# EAGLE design FETbox_rev0_PCB (EAGLE 9.6.2)
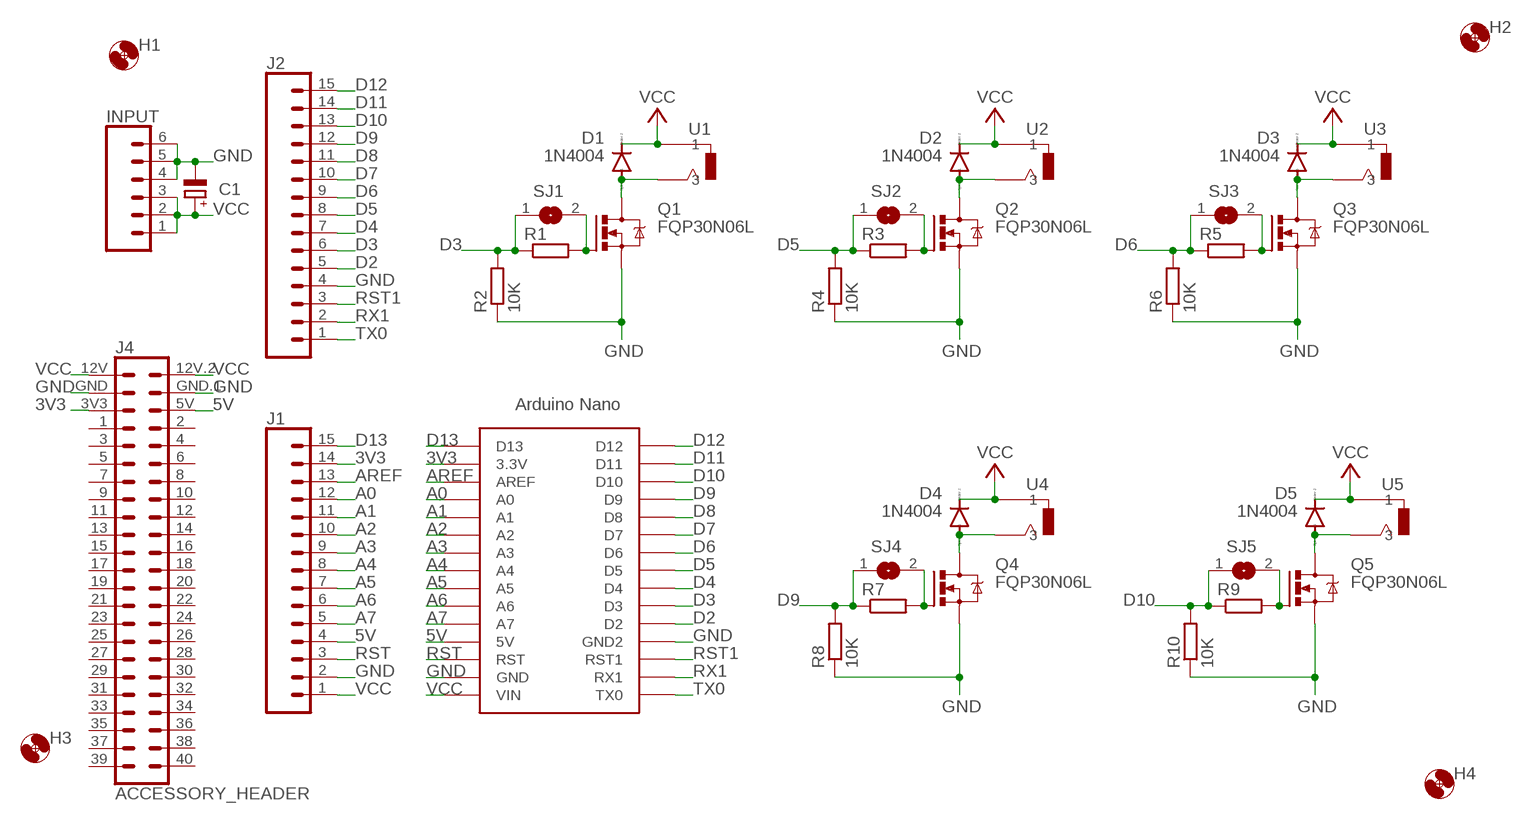
[diagram p0: schematic, sheet 1]

## Parts
C1  CPOL-EUE2.5-6  [E2,5-6]
D1  1N4004  [DO41-10]
D2  1N4004  [DO41-10]
D3  1N4004  [DO41-10]
D4  1N4004  [DO41-10]
D5  1N4004  [DO41-10]
H1  MOUNT-HOLE3.0  [3,0]
H2  MOUNT-HOLE3.0  [3,0]
H3  MOUNT-HOLE3.0  [3,0]
H4  MOUNT-HOLE3.0  [3,0]
INPUT  CONN_06LONGPADS  [1X06_LONGPADS]
J1  CONN_15  [1X15]
J2  CONN_15  [1X15]
J4  ACCESSORY_HEADER  [2X23]
Q1  FQP30N06L  [TO220]
Q2  FQP30N06L  [TO220]
Q3  FQP30N06L  [TO220]
Q4  FQP30N06L  [TO220]
Q5  FQP30N06L  [TO220]
R1  100  R-EU_0207/10  [0207/10]
R2  10K  R-EU_0207/10  [0207/10]
R3  100  R-EU_0207/10  [0207/10]
R4  10K  R-EU_0207/10  [0207/10]
R5  100  R-EU_0207/10  [0207/10]
R6  10K  R-EU_0207/10  [0207/10]
R7  100  R-EU_0207/10  [0207/10]
R8  10K  R-EU_0207/10  [0207/10]
R9  100  R-EU_0207/10  [0207/10]
R10  10K  R-EU_0207/10  [0207/10]
SJ1  SJ  [SJ]
SJ2  SJ  [SJ]
SJ3  SJ  [SJ]
SJ4  SJ  [SJ]
SJ5  SJ  [SJ]
U1  CL13845G  [CL13845G]
U2  CL13845G  [CL13845G]
U3  CL13845G  [CL13845G]
U4  CL13845G  [CL13845G]
U5  CL13845G  [CL13845G]
U$2  NANO  [NANO]

## Nets
3V3: J1.14 J4.3V3 U$2.3.3V
5V: J1.4 J4.5V U$2.5V
A0: J1.12 U$2.A0
A1: J1.11 U$2.A1
A2: J1.10 U$2.A2
A3: J1.9 U$2.A3
A4: J1.8 U$2.A4
A5: J1.7 U$2.A5
A6: J1.6 U$2.A6
A7: J1.5 U$2.A7
AREF: J1.13 U$2.AREF
D2: J2.5 U$2.D2
D3: J2.6 R1.1 R2.2 SJ1.1 U$2.D3
D4: J2.7 U$2.D4
D5: J2.8 R3.1 R4.2 SJ2.1 U$2.D5
D6: J2.9 R5.1 R6.2 SJ3.1 U$2.D6
D7: J2.10 U$2.D7
D8: J2.11 U$2.D8
D9: J2.12 R7.1 R8.2 SJ4.1 U$2.D9
D10: J2.13 R9.1 R10.2 SJ5.1 U$2.D10
D11: J2.14 U$2.D11
D12: J2.15 U$2.D12
D13: J1.15 U$2.D13
GND: C1.- INPUT.4 INPUT.5 INPUT.6 J1.2 J2.4 J4.GND J4.GND.1 Q1.S Q2.S Q3.S Q4.S Q5.S R2.1 R4.1 R6.1 R8.1 R10.1 U$2.GND U$2.GND1(GND2)
N$1: Q1.G R1.2 SJ1.2
N$2: D1.A Q1.D U1.S1 U1.S2
N$3: D2.A Q2.D U2.S1 U2.S2
N$4: Q2.G R3.2 SJ2.2
N$5: D3.A Q3.D U3.S1 U3.S2
N$6: Q3.G R5.2 SJ3.2
N$7: D4.A Q4.D U4.S1 U4.S2
N$8: Q4.G R7.2 SJ4.2
N$9: D5.A Q5.D U5.S1 U5.S2
N$10: Q5.G R9.2 SJ5.2
RST: J1.3 U$2.RST
RST1: J2.3 U$2.RST1
RX1: J2.2 U$2.RX1
TX0: J2.1 U$2.TX0
VCC: C1.+ D1.C D2.C D3.C D4.C D5.C INPUT.1 INPUT.2 INPUT.3 J1.1 J4.12V J4.12V.2(12V.1) U1.T1 U1.T2 U2.T1 U2.T2 U3.T1 U3.T2 U4.T1 U4.T2 U5.T1 U5.T2 U$2.RAW(VIN)
Unconnected: J4.1 J4.2 J4.3 J4.4 J4.5 J4.6 J4.7 J4.8 J4.9 J4.10 J4.11 J4.12 J4.13 J4.14 J4.15 J4.16 J4.17 J4.18 J4.19 J4.20 J4.21 J4.22 J4.23 J4.24 J4.25 J4.26 J4.27 J4.28 J4.29 J4.30 J4.31 J4.32 J4.33 J4.34 J4.35 J4.36 J4.37 J4.38 J4.39 J4.40

## Library data of the parts
C1 = rcl:CPOL-EU: POLARIZED CAPACITOR, European symbol; SPICEPREFIX: C
D1-D5 = diode:1N4004: DIODE general purpose rectifier, 1 A
H1-H4 = holes:MOUNT-HOLE: MOUNTING HOLE with drill center marker
INPUT = SparkFun-Connectors:CONN_06: Multi connection point. Often used as Generic Header-pin footprint for 0.1 inch spaced/style header connections On any of the 0.1 inch spaced packages, you can populate with these: Break Away Headers - Straight <https://www.sparkfun.com/products/116> (PRT-00116) Break Away Male Headers - Right Angle <https://www.sparkfun.com/products/553> (PRT-00553) Female Headers <https://www.sparkfun.com/products/115> (PRT-00115) Break Away Headers - Machine Pin <https://www.sparkfun.com/products/117> (PRT-00117) Break Away Female Headers - Swiss Machine Pin <https://www.sparkfun.com/products/743> (PRT-00743) Arduino Stackable Header - 6 Pin <https://www.sparkfun.com/products/9280> (PRT-09280) For SCREWTERMINALS and SPRING TERMINALS visit here: Screw Terimnals on SparkFun.com <https://www.sparkfun.com/search/results?term=Screw+Terminals> (5mm/3.5mm/2.54mm spacing) This device is also useful as a general connection point to wire up your design to another part of your project. Our various solder wires solder well into these plated through hole pads. Hook-Up Wire - Assortment (Stranded, 22 AWG) <https://www.sparkfun.com/products/11375> (PRT-11375) Hook-Up Wire - Assortment (Solid Core, 22 AWG) <https://www.sparkfun.com/products/11367> (PRT-11367) View the entire wire category on our website here <https://www.sparkfun.com/categories/141>
J1 J2 = SparkFun-Connectors:CONN_15: Multi connection point. Often used as Generic Header-pin footprint for 0.1 inch spaced/style header connections On any of the 0.1 inch spaced packages, you can populate with these: Break Away Headers - Straight <https://www.sparkfun.com/products/116> (PRT-00116) Break Away Male Headers - Right Angle <https://www.sparkfun.com/products/553> (PRT-00553) Female Headers <https://www.sparkfun.com/products/115> (PRT-00115) Break Away Headers - Machine Pin <https://www.sparkfun.com/products/117> (PRT-00117) Break Away Female Headers - Swiss Machine Pin <https://www.sparkfun.com/products/743> (PRT-00743) For SCREWTERMINALS and SPRING TERMINALS visit here: Screw Terimnals on SparkFun.com <https://www.sparkfun.com/search/results?term=Screw+Terminals> (5mm/3.5mm/2.54mm spacing) This device is also useful as a general connection point to wire up your design to another part of your project. Our various solder wires solder well into these plated through hole pads. Hook-Up Wire - Assortment (Stranded, 22 AWG) <https://www.sparkfun.com/products/11375> (PRT-11375) Hook-Up Wire - Assortment (Solid Core, 22 AWG) <https://www.sparkfun.com/products/11367> (PRT-11367) View the entire wire category on our website here <https://www.sparkfun.com/categories/141> Special notes: Molex polarized connector foot print use with SKU : PRT-08231 with associated crimp pins and housings. 1MM SMD Version SKU: PRT-10208 NOTES ON THE VARIANTS LOCK and LOCK_LONGPADS... This footprint was designed to help hold the alignment of a through-hole component (i.e. 6-pin header) while soldering it into place. You may notice that each hole has been shifted either up or down by 0.005 of an inch from it's more standard position (which is a perfectly straight line). This slight alteration caused the pins (the squares in the middle) to touch the edges of the holes. Because they are alternating, it causes a "brace" to hold the component in place. 0.005 has proven to be the perfect amount of "off-center" position when using our standard breakaway headers. Although looks a little odd when you look at the bare footprint, once you have a header in there, the alteration is very hard to notice. Also,if you push a header all the way into place, it is covered up entirely on the bottom side.
J4 = PerfusionHardwareController:ACCESSORY_HEADER
Q1-Q5 = PerfusionHardwareController:FQP30N06L: QFET Power MOSFET
R1-R10 = rcl:R-EU_: RESISTOR, European symbol; SPICEPREFIX: R
SJ1-SJ5 = jumper:SJ: SMD solder JUMPER
U1-U5 = PerfusionHardwareController:CL13845G
U$2 = Arduino-clone:NANO: Arduino Nano

## Net classes
0 default: width 0.305 mm, clearance 0.254 mm

## Board
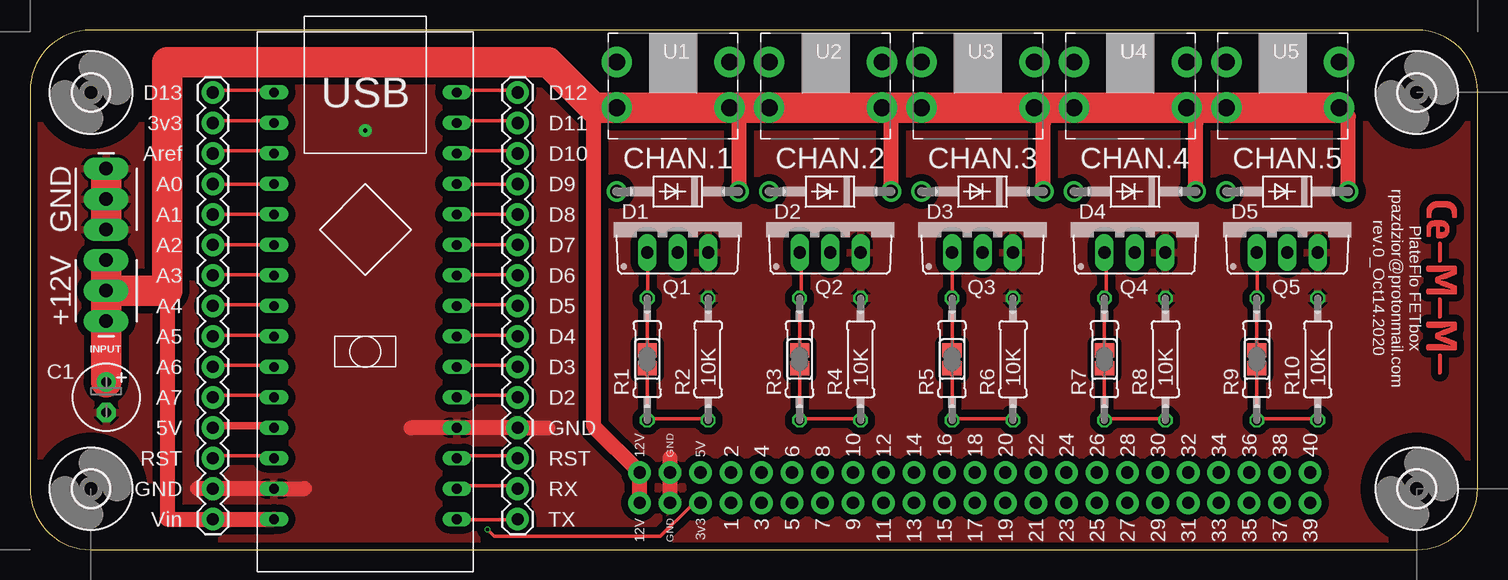
[diagram p1: board, top side]
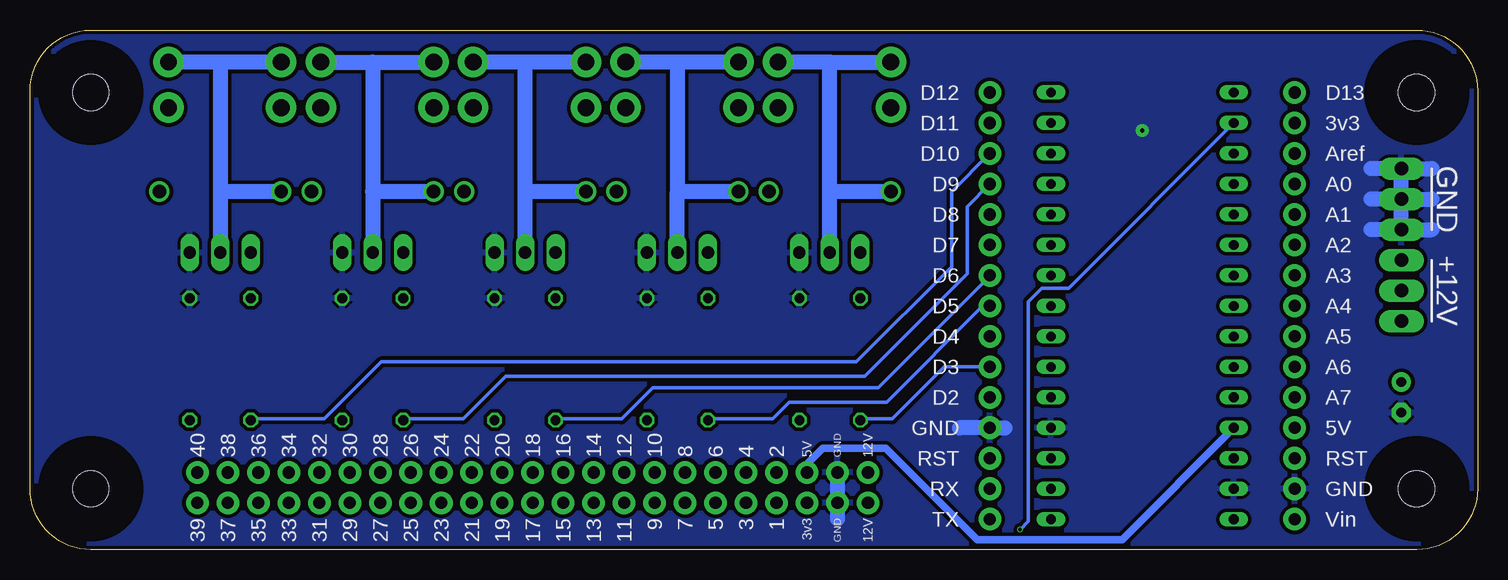
[diagram p2: board, bottom side, seen from below]

Size 120.63 x 43.31 mm. Coordinates in mm from the lower left corner, seen from the top.
Outline: 0,38.23 0,5.08 arc90 5.08,0 115.55,0 arc90 120.63,5.09 120.63,38.21 arc90 115.55,43.31 5.08,43.31 arc90 0,38.23
Copper layers (1*16): Top 0.035559375mm / dielectric 1.6mm / Bottom 0.035559375mm
Design rules "jlcpcb2layer": minimum track width 5mil, minimum drill 12mil, track to track 5mil, track to pad 5mil, pad to pad 5mil, via to via 5mil, smd to smd 5mil, copper to edge 8mil, drill to drill 6mil, minimum pad ring 5mil, minimum via ring 3mil, stop-mask expansion 2.5mil, vias tented up to drill 0mil, thermal gap 10mil

### Footprints (pad centres in the part's own frame; a part is rotated, then mirrored left to right if it is on the bottom)
E2,5-6 = drill 0.813 pad 1.6: + -1.27,0 | drill 0.813 pad 1.6 octagon: - 1.27,0
DO41-10 = drill 1.118: A 5.08,0; C -5.08,0
3,0 = hole 3: 0,0
1X06_LONGPADS = drill 1.118 pad 1.88 long: 1 0,0; 2 2.54,0; 3 5.08,0; 4 7.62,0; 5 10.16,0; 6 12.7,0
1X15 = drill 1.016 pad 1.88: 1 0,0; 2 2.54,0; 3 5.08,0; 4 7.62,0; 5 10.16,0; 6 12.7,0; 7 15.24,0; 8 17.78,0; 9 20.32,0; 10 22.86,0; 11 25.4,0; 12 27.94,0; 13 30.48,0; 14 33.02,0; 15 35.56,0
2X23 = drill 1.016 pad 1.88: 1 0,0; 2 0,2.54; 3 2.54,0; 3V3 -2.54,0; 4 2.54,2.54; 5 5.08,0; 5V -2.54,2.54; 6 5.08,2.54; 7 7.62,0; 8 7.62,2.54; 9 10.16,0; 10 10.16,2.54; 11 12.7,0; 12 12.7,2.54; 12V -7.62,0; 12V.2 -7.62,2.54; 13 15.24,0; 14 15.24,2.54; 15 17.78,0; 16 17.78,2.54; 17 20.32,0; 18 20.32,2.54; 19 22.86,0; 20 22.86,2.54; 21 25.4,0; 22 25.4,2.54; 23 27.94,0; 24 27.94,2.54; 25 30.48,0; 26 30.48,2.54; 27 33.02,0; 28 33.02,2.54; 29 35.56,0; 30 35.56,2.54; 31 38.1,0; 32 38.1,2.54; 33 40.64,0; 34 40.64,2.54; 35 43.18,0; 36 43.18,2.54; 37 45.72,0; 38 45.72,2.54; 39 48.26,0; 40 48.26,2.54; GND -5.08,0; GND.1 -5.08,2.54
TO220 = drill 1.016 long: D 0,-2.54; G -2.54,-2.54; S 2.54,-2.54
0207/10 = drill 0.813 octagon: 1 -5.08,0; 2 5.08,0
SJ = smd 1.168 x 1.6: 1 -0.762,0; 2 0.762,0
CL13845G = drill 1.4 pad 2.54: S1 0,0; S2 9.4,0; T1 0,-3.8; T2 9.4,-3.8
NANO = drill 0.8 long: 3.3V -7.62,-2.54; 5V -7.62,-27.94; A0 -7.62,-7.62; A1 -7.62,-10.16; A2 -7.62,-12.7; A3 -7.62,-15.24; A4 -7.62,-17.78; A5 -7.62,-20.32; A6 -7.62,-22.86; A7 -7.62,-25.4; AREF -7.62,-5.08; D2 7.62,-25.4; D3 7.62,-22.86; D4 7.62,-20.32; D5 7.62,-17.78; D6 7.62,-15.24; D7 7.62,-12.7; D8 7.62,-10.16; D9 7.62,-7.62; D10 7.62,-5.08; D11 7.62,-2.54; D12 7.62,0; D13 -7.62,0; GND -7.62,-33.02; GND1 7.62,-27.94; RAW -7.62,-35.56; RST -7.62,-30.48; RST1 7.62,-30.48; RX1 7.62,-33.02; TX0 7.62,-35.56

### Placement (x,y rotation side)
C1  6.35,12.7 270 top
D1  53.98,29.84 180 top
D2  66.67,29.84 180 top
D3  79.38,29.84 180 top
D4  92.08,29.84 180 top
D5  104.78,29.84 180 top
H1  115.57,38.1 0 top
H2  5.08,38.1 0 top
H3  5.08,5.08 0 top
H4  115.57,5.08 0 top
INPUT  6.35,19.05 90 top
J1  15.24,2.54 90 top
J2  40.64,2.54 90 top
J4  58.42,3.9 0 top
Q1  53.98,27.3 0 top
Q2  66.67,27.3 0 top
Q3  79.38,27.3 0 top
Q4  92.08,27.3 0 top
Q5  104.78,27.3 0 top
R1  51.44,15.88 90 top
R2  56.52,15.88 270 top
R3  64.14,15.88 90 top
R4  69.22,15.88 270 top
R5  76.83,15.88 90 top
R6  81.92,15.88 270 top
R7  89.53,15.88 90 top
R8  94.61,15.88 270 top
R9  102.23,15.88 90 top
R10  107.31,15.88 270 top
SJ1  51.44,15.88 90 top
SJ2  64.14,15.88 90 top
SJ3  76.83,15.88 90 top
SJ4  89.53,15.88 90 top
SJ5  102.23,15.88 90 top
U1  48.9,40.64 0 top
U2  61.59,40.64 0 top
U3  74.3,40.64 0 top
U4  87,40.64 0 top
U5  99.69,40.64 0 top
U$2  27.94,38.1 0 top

### Tracks (layer width: path | path; a pad name or v marks a point on that pad's centre or on a via)
3V3  (via drill 0.3)
  Top 0.305: U$2.3.3V 20.12,35.76 15.37,35.76 J1.14 | v38.12,1.68 38.68,1.12 52.53,1.12 55.04,3.63 55.88,3.63 J4.3V3
  Bottom 0.305: v38.12,1.68 37.44,2.36 37.44,20.68 36.32,21.79 34.09,21.79 U$2.3.3V
5V
  Top 0.305: 20.12,10.34 U$2.5V | 15.37,10.34 J1.4
  Top 0.61: 15.37,10.34 20.12,10.34
  Bottom 0.305: 20.4,10.06 U$2.5V
  Bottom 0.61: J4.5V 55.88,7.14 54.56,8.46 49.33,8.46 41.71,0.84 29.62,0.84 20.4,10.06
A0
  Top 0.305: U$2.A0 20.12,30.45 15.37,30.45 J1.12
A1
  Top 0.305: J1.11 U$2.A1
A2
  Top 0.305: U$2.A2 20.12,25.43 15.37,25.43 J1.10
A3
  Top 0.305: U$2.A3 20.12,22.91 15.37,22.91 J1.9
A4
  Top 0.305: U$2.A4 20.12,20.4 15.37,20.4 J1.8
A5
  Top 0.305: U$2.A5 20.12,17.88 15.37,17.88 J1.7
A6
  Top 0.305: U$2.A6 20.12,15.37 15.37,15.37 J1.6
A7
  Top 0.305: U$2.A7 20.12,12.85 15.37,12.85 J1.5
AREF
  Top 0.305: U$2.AREF 20.12,33.25 15.37,33.25 J1.13
D2
  Top 0.305: U$2.D2 35.76,12.85 40.51,12.85 J2.5
D3
  Top 0.305: R2.2 56.52,10.9 51.49,10.9 R1.1 SJ1.1 | U$2.D3 35.76,15.37 40.51,15.37 J2.6
  Bottom 0.305: J2.6 44.45,15.24 48.79,10.9 51.21,10.9 R1.1
D4
  Top 0.305: U$2.D4 35.76,17.88 40.51,17.88 J2.7
D5
  Top 0.305: R4.2 69.01,10.9 64.26,10.9 R3.1 SJ2.1 | U$2.D5 35.76,20.4 40.51,20.4 J2.8
  Bottom 0.305: J2.8 41.22,20.32 49.25,12.29 57.35,12.29 58.75,10.9 63.98,10.9 R3.1
D6
  Top 0.305: R6.2 81.86,10.9 76.83,10.9 R5.1 SJ3.1 | U$2.D6 35.76,22.91 40.51,22.91 J2.9
  Bottom 0.305: R5.1 76.83,10.9 71.32,10.9 68.73,13.49 49.94,13.49 40.64,22.78 J2.9
D7
  Top 0.305: U$2.D7 35.76,25.43 40.51,25.43 J2.10
D8
  Top 0.305: J2.11 U$2.D8
D9
  Top 0.305: R8.2 94.44,10.9 89.69,10.9 R7.1 SJ4.1 | U$2.D9 35.76,30.45 40.51,30.45 J2.12
  Bottom 0.305: J2.12 42.55,28.57 42.55,22.99 51.08,14.45 80.97,14.45 84.53,10.9 89.41,10.9 R7.1
D10
  Top 0.305: R10.2 107.29,10.9 102.26,10.9 R9.1 SJ5.1 | U$2.D10 35.76,33.25 40.51,33.25 J2.13
  Bottom 0.305: J2.13 43.81,29.84 43.81,23.6 51.77,15.65 91.36,15.65 96.11,10.9 101.98,10.9 R9.1
D11
  Top 0.305: U$2.D11 35.76,35.76 40.51,35.76 J2.14
D12
  Top 0.305: U$2.D12 35.76,38.28 40.51,38.28 J2.15
D13
  Top 0.305: U$2.D13 20.12,38.28 15.37,38.28 J1.15
GND  (via drill 0.35 pad 1.05)
  Top 0.305: J4.GND.1 53.37,6.43 53.37,6.31
  Top 1.27: 22.86,5.08 U$2.GND 13.97,5.08 | 43.18,10.16 J2.4 31.75,10.16 | J4.GND 53.34,7.62
  Top 2.54: 6.35,27.05 INPUT.5 6.35,31.24
  Bottom 0.305: 53.37,4.19 J4.GND
  Bottom 1.27: J4.GND.1 J4.GND 53.34,2.54 | 8.89,29.21 INPUT.5 3.81,29.21 | INPUT.6 8.89,31.75 | INPUT.6 3.81,31.75 | INPUT.4 INPUT.6 | INPUT.4 3.81,26.67 | INPUT.4 8.89,26.67 | 39.37,10.16 J2.4 43.18,10.16
  other vias: 27.94,34.92
  pour Bottom (isolate 0.305): 0,43.18 0,0 120.65,0 120.65,43.18
  pour Top (isolate 0.61): 0,43.18 0,0 121.28,0 121.28,43.18
N$1
  Top 0.305: Q1.G 51.49,24.59 51.49,20.95 R1.2 SJ1.2
N$2
  Bottom 1.27: D1.A 53.98,29.84 | Q1.D 53.98,29.84 | 53.98,29.84 53.98,40.64 | 53.98,40.64 U1.S1 | 53.98,40.64 U1.S2
N$3
  Bottom 1.27: Q2.D 66.67,29.84 | D2.A 66.67,29.84 | U2.S1 66.67,40.64 | 66.67,40.64 U2.S2 | 66.67,40.64 66.67,29.84
N$4
  Top 0.305: 64.26,20.95 64.26,24.59 Q2.G | 64.26,20.95 R3.2 | SJ2.2 64.14,20.83 64.26,20.95
N$5
  Bottom 1.27: Q3.D 79.38,29.84 | 79.38,29.84 79.38,40.64 | 79.38,40.64 U3.S2 | U3.S1 79.38,40.64 | D3.A 79.38,29.84
N$6
  Top 0.305: Q3.G R5.2 SJ3.2
N$7
  Bottom 1.27: D4.A 92.08,29.84 | 92.08,29.84 Q4.D | U4.S2 92.08,40.64 | 92.08,40.64 U4.S1 | 92.08,40.64 92.08,29.84
N$8
  Top 0.305: Q4.G 89.69,24.59 89.69,20.95 R7.2 SJ4.2
N$9
  Bottom 1.27: U5.S1 104.78,40.64 | 104.78,40.64 U5.S2 | 104.78,40.64 104.78,29.84 | D5.A 104.78,29.84 | 104.78,29.84 Q5.D
N$10
  Top 0.305: Q5.G 102.26,24.59 102.26,20.95 R9.2 SJ5.2
RST
  Top 0.305: U$2.RST 20.12,7.82 15.37,7.82 J1.3
RST1
  Top 0.305: J2.3 40.51,7.82 35.76,7.82 U$2.RST1
RX1
  Top 0.305: U$2.RX1 35.76,5.31 40.51,5.31 J2.2
TX0
  Top 0.305: U$2.TX0 35.76,2.52 40.51,2.52 J2.1
VCC
  Top 0.305: 84.45,35.56 84.66,35.76 84.66,36.84 | 97.16,35.56 97.23,35.76 97.23,36.84 | U4.T1 86.89,36.88 86.89,36.84 | U4.T2 96.39,36.88 U4.T2 | U5.T1 99.75,36.88 99.75,36.84 | 46.99,35.76 46.94,35.76 46.99,36.83 | INPUT.3 6.37,24.1 6.35,23.75 | 6.35,20.95 6.43,20.95 INPUT.2
  Top 1.27: 11.43,21.59 11.43,2.54 J1.1 U$2.RAW | J4.12V J4.12V.2 46.99,10.25 46.99,35.76 | U1.T2 59.05,36.08 D1.C | U2.T2 71.75,36.08 D2.C | D3.C 84.45,35.56 | D4.C 97.16,35.56 | U5.T2 109.86,36.08 D5.C
  Top 2.54: U1.T2 U1.T1 48.88,36.83 46.99,36.83 43.18,40.64 11.43,40.64 11.43,21.59 INPUT.2 | U1.T2 U2.T1 | U2.T2 U3.T1 | U1.T2 U2.T2 | U2.T2 U3.T2 84.66,36.84 86.89,36.84 U4.T1 U4.T2 97.23,36.84 U5.T1 99.75,36.84 U5.T2 | C1.+ INPUT.1 6.35,20.95 INPUT.2 | INPUT.2 6.35,23.75
  Bottom 0.305: 84.38,29.9 D3.C
(copper drawn outside any net)
  shapes: Top area x1581

### Text on the board
tPlace: D13 | D12 | 3v3 | D11 | Aref | D10 | CHAN.1 | CHAN.2 | CHAN.3 | CHAN.4 | CHAN.5 | A0 | D9 | GND | A1 | D8 | A2 | D7 | A3 | D6 | +12V | PlateFlo FETbox / rpazdzior@protonmail.com / rev.0_Oct14.2020 | A4 | D5 | A5 | D4 | A6 | D3 | A7 | D2 | 5V | GND | RST | RST | GND | RX | Vin | TX
bPlace: D13 | D12 | 3v3 | D11 | Aref | D10 | A0 | D9 | GND | A1 | D8 | A2 | D7 | A3 | D6 | +12V | A4 | D5 | A5 | D4 | A6 | D3 | A7 | D2 | 5V | GND | RST | RST | GND | RX | Vin | TX
tDocu: Robert Pazdzior | PlateFlo FETbox | Arduino Nano MOSFET + Breakout Board | rev.0_Oct14.2020